# EAGLE design LED Board (EAGLE 7.5.0)
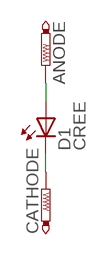
[diagram p0: schematic, sheet 1]

## Parts
ANODE  PTR1PAD1-20  [P1-20]
CATHODE  PTR1PAD1-20  [P1-20]
D1  CREE  [CREE-XLAMP-XM-L]

## Nets
CAM_LEDV: ANODE.TP D1.A D1.A@1(A)
GND: CATHODE.TP D1.C D1.C1(C) D1.C@1(C)

## Library data of the parts
ANODE CATHODE = testpad:PTR1: TEST PIN
D1 = 2015_LED_Driver:CREE: Cree XBD model LED's digikey # XBDAWT-00-0000-000000F51CT-ND

## Board
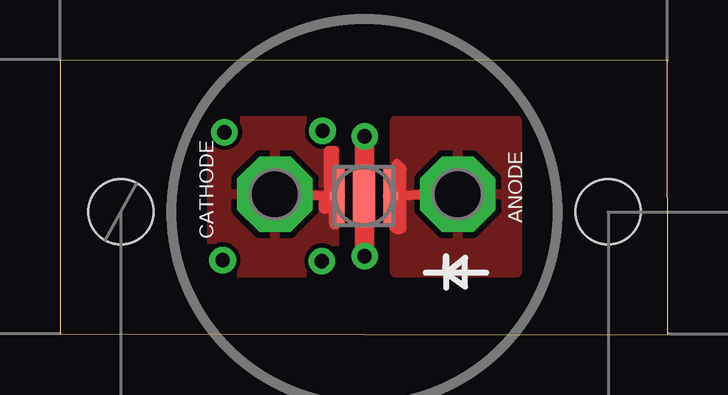
[diagram p1: board, top side]
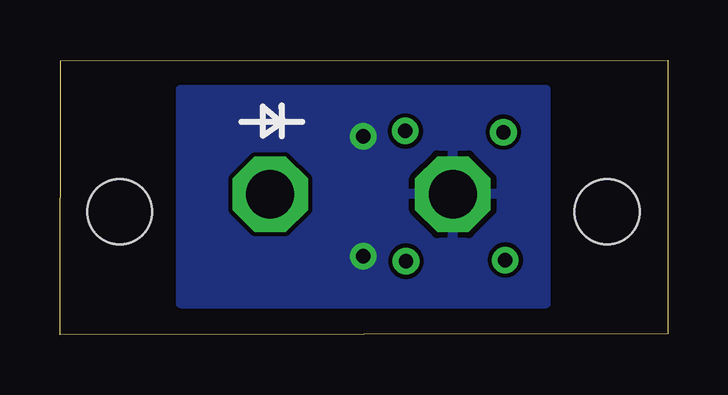
[diagram p2: board, bottom side, seen from below]

Size 25.35 x 11.47 mm. Coordinates in mm from the lower left corner, seen from the top.
Outline: 0,0.05 25.35,0 25.32,11.45 0,11.47 0,0.05
Copper layers (1*16): Top 0.035mm / dielectric 1.5mm / Bottom 0.035mm
Design rules "GoldPhoenix": minimum track width 7mil, minimum drill 10mil, track to track 7mil, track to pad 7mil, pad to pad 7mil, via to via 7mil, smd to smd 7mil, copper to edge 10mil, drill to drill 8mil, minimum pad ring 10mil, minimum via ring 10mil, stop-mask expansion 4mil, vias tented up to drill 25mil, thermal gap 10mil
Holes 2.71 mm at 22.86,5.13 2.54,5.13

### Footprints (pad centres in the part's own frame; a part is rotated, then mirrored left to right if it is on the bottom)
P1-20 = drill 2.007 pad 3.15 octagon: TP 0,0
CREE-XLAMP-XM-L = smd 0.33 x 2.29: A 0.985,0; C1 -1,0 | smd 0.28 x 0.36: A@1 1.27,0; C@1 -1.27,0 | smd 0.36 x 2.34: C -0.985,0 | smd 0.92 x 2.29: EXP 0,0

### Placement (x,y rotation side)
ANODE  16.59,5.87 0 top
CATHODE  8.97,5.87 0 top
D1  12.67,5.79 0 top

### Tracks (layer width: path | path; a pad name or v marks a point on that pad's centre or on a via)
CAM_LEDV
  Top 0.305: 14.25,6.93 14.05,6.93 | 14.05,6.93 14.05,7.14 | 14.05,6.93 14,6.4 D1.A@1
  Top 0.406: ANODE.TP D1.A@1 | 13.87,6.86 13.95,4.47 13.99,4.42 14.22,4.42 14.25,4.44 14.25,6.93 14.05,7.14 | D1.A 14,5.79 14,6.4
  pour Top: 13.97,8.94 19.05,8.94 19.05,2.59 13.97,2.59
GND  (via drill 0.6)
  Top 0.305: D1.C1 D1.C@1
  Top 0.406: CATHODE.TP D1.C@1 | D1.C@1 11.51,4.6 11.43,4.6 11.43,5.51 | D1.C D1.C@1 | 11.43,5.51 11.43,7.67 11.2,7.67 11.2,5.74 11.07,5.74 11.07,5.26 11,5.26 11,5.51 11.43,5.51
  Top 0.813: v12.7,3.28 12.7,8.25
  other vias: 12.7,8.28
  pour Bottom: 5.08,10.21 20.32,10.21 20.32,1.32 5.08,1.32
  pour Top: 6.35,8.94 11.43,8.94 11.43,2.59 6.35,2.59
  pour Top: 12.9,5.51 12.93,5.51 12.9,5.41
N$1  (via drill 0.6)
  other vias: 6.86,8.46
N$2  (via drill 0.6)
  other vias: 10.95,8.51
N$3  (via drill 0.6)
  other vias: 6.78,3.12
N$4  (via drill 0.6)
  other vias: 10.92,3.07